# EAGLE schematic AI_SPEAKER (EAGLE 7.5.0)
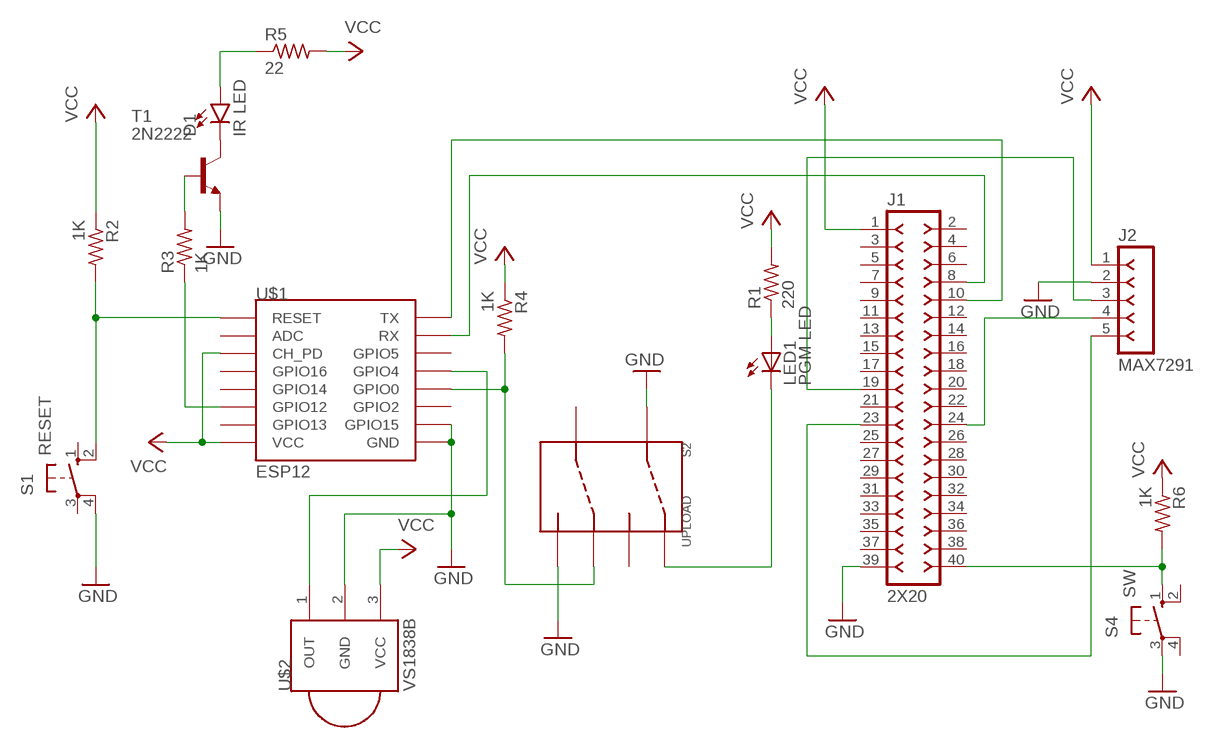
[diagram p0: schematic, sheet 1]

## Parts
D1  IR LED  LED-IRTSAL6100  [LED_5MM]
J1  2X20  F-2X20-DIL-100  [DIL-100-2X20]
J2  MAX7291  F-1X05-SIP-100-40  [SIP-100-05-40]
LED1  PGM LED  LED3MM  [LED3MM]
R1  220  R-US_0207/10  [0207/10]
R2  1K  R-US_0207/10  [0207/10]
R3  1K  R-US_0207/10  [0207/10]
R4  1K  R-US_0207/10  [0207/10]
R5  22  R-US_0207/10  [0207/10]
R6  1K  R-US_0207/10  [0207/10]
S1  RESET  10-XX  [B3F-10XX]
S2  UPLOAD  SWITCH-6PIN-LOCK-2.54MM  [SWITCH-6PIN-LOCK-2.54MM]
S4  SW  10-XX  [B3F-10XX]
T1  2N2222  2N2222-NPN-TO92-EBC  [TO92-EBC]
U$1  ESP12  [ESP12]
U$2  VS1838B  PNA460XM  [PNA460XM]

## Nets
GND: J1.39 J2.2 S1.4(P1) S2.P$1 S2.P$6 S4.3(P) T1.E U$1.GND U$1.GPIO15 U$2.2(GND)
N$1: R2.2 S1.2(S1) U$1.RESET
N$2: J1.19 J2.3
N$3: D1.A R5.1
N$4: D1.K(C) T1.C
N$5: R3.2 T1.B
N$6: R3.1 U$1.GPIO12
N$7: R4.2 S2.P$5 U$1.GPIO0
N$8: LED1.A R1.1
N$9: LED1.K(C) S2.P$2
N$10: J1.40 R6.2 S4.1(S)
N$11: J1.24 J2.4
N$12: J1.23 J2.5
N$13: J1.8 U$1.RX
N$14: J1.10 U$1.TX
N$15: U$1.GPIO5(GPIO4) U$2.1(OUT)
VCC: J1.1 J2.1 R1.2 R2.1 R4.1 R5.2 R6.1 U$1.CH_PD U$1.VCC U$2.3(VCC)
Unconnected: J1.2 J1.3 J1.4 J1.5 J1.6 J1.7 J1.9 J1.11 J1.12 J1.13 J1.14 J1.15 J1.16 J1.17 J1.18 J1.20 J1.21 J1.22 J1.25 J1.26 J1.27 J1.28 J1.29 J1.30 J1.31 J1.32 J1.33 J1.34 J1.35 J1.36 J1.37 J1.38 S1.1(S) S1.3(P) S2.P$3 S2.P$4 S4.2(S1) S4.4(P1) U$1.ADC U$1.GPIO2 U$1.GPIO4(GPIO5) U$1.GPIO13 U$1.GPIO14 U$1.GPIO16

## Library data of the parts
D1 = SparkFun-LED:LED-IR: Infrared LED (IR) Wavelength: 940nm Packages: TSAL6100 LTE302 - Side firing. Check SparkFun-Sensors.lbr for the receiver SparkFun Products: ZX Distance and Gesture Sensor <[https://www.sparkfun.com/products/12780]> Infrared Emitters and Detectors <https://www.sparkfun.com/products/241>; PROD_ID: DIO-12058; SPICEPREFIX: D
J1 = con-headers-jp:F-2X20-: FEMALE HEADER
J2 = con-headers-jp:F-1X05-: FEMALE HEADER
LED1 = adafruit:LED: LED OSRAM: - CHIPLED LG R971, LG N971, LY N971, LG Q971, LY Q971, LO R971, LY R971 LH N974, LH R974 LS Q976, LO Q976, LY Q976 LO Q996 - Hyper CHIPLED LW Q18S LB Q993, LB Q99A, LB R99A - SideLED LS A670, LO A670, LY A670, LG A670, LP A670 LB A673, LV A673, LT A673, LW A673 LH A674 LY A675 LS A676, LA A676, LO A676, LY A676, LW A676 LS A679, LY A679, LG A679 - Hyper Micro SIDELED® LS Y876, LA Y876, LO Y876, LY Y876 LT Y87S - SmartLED LW L88C, LW L88S LB L89C, LB L89S, LG L890 LS L89K, LO L89K, LY L89K LS L896, LA L896, LO L896, LY L896 - TOPLED LS T670, LO T670, LY T670, LG T670, LP T670 LSG T670, LSP T670, LSY T670, LOP T670, LYG T670 LG T671, LOG T671, LSG T671 LB T673, LV T673, LT T673, LW T673 LH T674 LS T676, LA T676, LO T676, LY T676, LB T676, LH T676, LSB T676, LW T676 LB T67C, LV T67C, LT T67C, LS T67K, LO T67K, LY T67K, LW E67C LS E67B, LA E67B, LO E67B, LY E67B, LB E67C, LV E67C, LT E67C LW T67C LS T679, LY T679, LG T679 LS T770, LO T770, LY T770, LG T770, LP T770 LB T773, LV T773, LT T773, LW T773 LH T774 LS E675, LA E675, LY E675, LS T675 LS T776, LA T776, LO T776, LY T776, LB T776 LHGB T686 LT T68C, LB T68C - Hyper Mini TOPLED® LB M676 - Mini TOPLED Santana® LG M470 LS M47K, LO M47K, LY M47K Source: http://www.osram.convergy.de/
R1-R6 = rcl:R-US_: RESISTOR, American symbol; SPICEPREFIX: R
S1 S4 = switch-omron:10-XX: OMRON SWITCH; MPN: B3F-1000; OC_FARNELL: 176432; OC_NEWARK: 36M3542
S2 = Itead_BP_110825.lbr:SWITCH-6PIN-LOCK-2.54MM: SOC016
T1 = transistor-neu-to92:*-NPN-: NPN Transistror
U$1 = esp-12e:ESP12: ESP8266 Wifi module 12
U$2 = adafruit:PNA460XM: IR 38KHz receiver PNA4602 and related receivers http://www.ladyada.net/library/pcb/eaglelibrary.html